# Altium schematic sheet Power.SchDoc
size A4; SheetNumber: 2; SheetTotal: 2
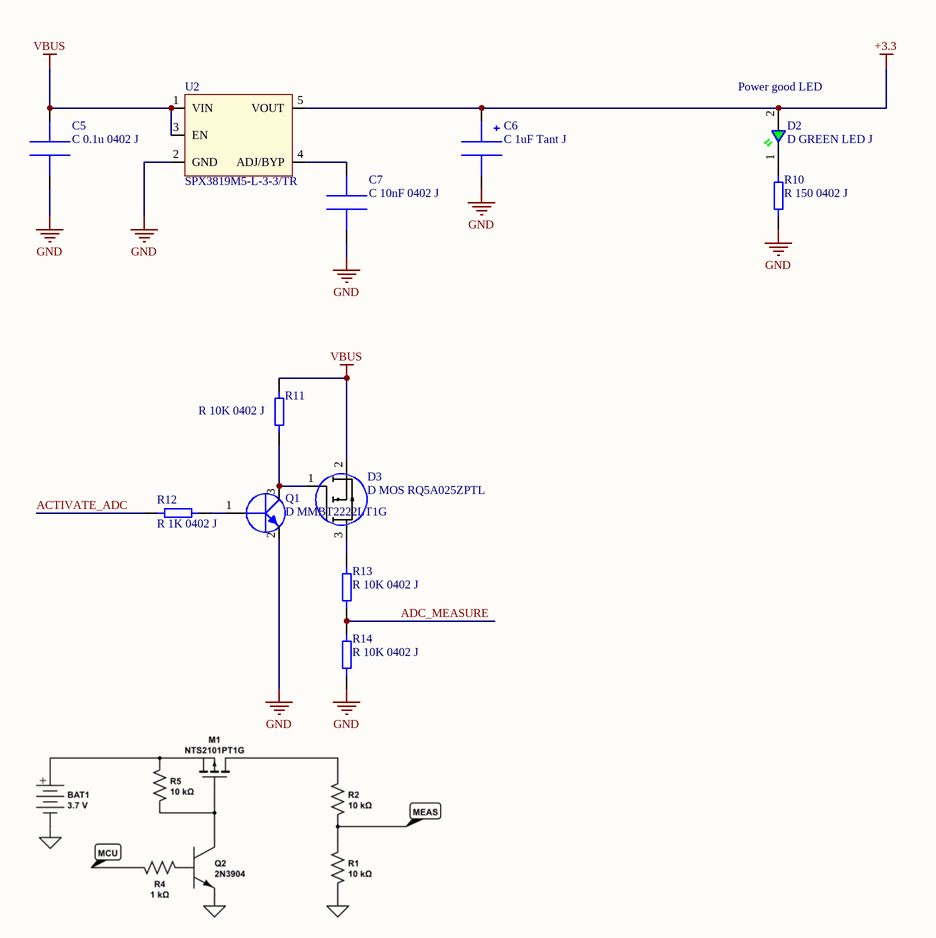
[diagram p0: Power.SchDoc]

## Parts
C5  C 0.1u 0402 J  [C0402]
C6  C 1uF Tant J  [C AVX CAP TANT CASE A]
C7  C 10nF 0402 J  [C0402]
D2  D GREEN LED J  [NCD0402C1]
D3  D MOS RQ5A025ZPTL  [SC96 SOT346T]
Q1  D MMBT2222LT1G  [SOT23]
R10  R 150 0402 J  [R0402]
R11  R 10K 0402 J  [R0402]
R12  R 1K 0402 J  [R0402]
R13  R 10K 0402 J  [R0402]
R14  R 10K 0402 J  [R0402]
U2  SPX3819M5-L-3-3/TR  [SOT23-5]

## Nets
+3.3: C6.A D2.2 U2.5(VOUT)
GND: C5.1 C6.K C7.1 Q1.2 R10.1 R14.1 U2.2(GND)
VBUS: C5.2 D3.2(S) R11.2 U2.1(VIN) U2.3(EN)
ACTIVATE_ADC: R12.1
ADC_MEASURE: R13.1 R14.2
NetC7_2: C7.2 U2.4(ADJ/BYP)
NetD2_1: D2.1 R10.2
NetD3_1: D3.1(G) Q1.3 R11.1
NetD3_3: D3.3(D) R13.2
NetQ1_1: Q1.1 R12.2

## Notes on the sheet
- (near D2) Power good LED

## Library data of the parts
C5 = C 0.1u 0402 J: Cap Ceramic 0.1uF 50V X7R 10% Pad SMD 0402 125C Low ESR Automotive CL05B104KB54PNC; Manufacturer: Samsung; Supplier 1: Digi-Key; Manufacturer Part Number: CL05B104KB54PNC; RoHS: Yes; Category: Ceramic Capacitors; Stock 1: 3863336; Pricing 1: 1=0,10000, 10=0,04600, 50=0,02500, 100=0,02040, 500=0,01460, 1000=0,01147, 2500=0,01043, 5000=0,00959 (USD); RoHS Compliant: Yes; Supplier Part Number 1: 1276-CL05B104KB54PNCCT-ND; JLCPCB: C307331
C6 = C 1uF Tant J: Cap Tant Solid 1uF 16V A CASE 10%( 3.2 X 1.6 X 1.6mm) Inward L SMD 3216-18 11 Ohm 125C T/R TAJA105K016RNJ; Manufacturer: Kyocera AVX; Dielectric Material: Tantalum; Tolerance: 20%; ESR (Equivalent Series Resistance): 11R; Polarity: Polar; Leakage Current: 500nA; Dissipation Factor: 4%; Supplier 1: Digi-Key; Manufacturer Part Number: TAJA105K016RNJ; RoHS: Yes; Category: Tantalum Capacitors; Stock 1: 449202; Pricing 1: 2000=0,09159, 4000=0,08650, 10000=0,08141, 14000=0,07886, 50000=0,07123 (USD); Mount: Surface Mount,PCB; Case/Package: 1206; Number of Pins: 2; Case Code (Metric): 3216; Case Code (Imperial): 1206; Weight: 0.000571oz; Min Operating Temperature: -55°C; Max Operating Temperature: 125°C; Capacitance: 1uF; Voltage Rating (DC): 16V; Packaging: Tape and Reel; Package Quantity: 1; Voltage Rating: 16V; Termination: SMD/SMT; Voltage: 16V; Features: General Purpose; Series: TAJ; Length: 3.2mm; Width: 1.6mm; Height: 1.6mm; Height - Seated (Max): 0.071inch; Depth: 1.6mm; Lead Pitch: 1.1mm; Radiation Hardening: No; REACH SVHC: No SVHC; Lead Free: Lead Free; RoHS Compliant: Yes; ComponentLink1URL: https://datasheet.ciiva.com/18710/taj-eng-18710647.pdf?src-supplier=Distrelec; ComponentLink1Description: https://datasheet.ciiva.com/18710/taj-eng-18710647.pdf?src-supplier=Distrelec; ComponentLink2URL: https://datasheet.ciiva.com/7832/taj-7832811.pdf?src-supplier=Element14; ComponentLink2Description: https://datasheet.ciiva.com/7832/taj-7832811.pdf?src-supplier=Element14; ComponentLink3URL: https://datasheet.ciiva.com/7832/taj-7832810.pdf?src-supplier=Element14; ComponentLink3Description: https://datasheet.ciiva.com/7832/taj-7832810.pdf?src-supplier=Element14; ComponentLink4URL: https://datasheet.ciiva.com/7832/1680476-7832431.pdf?src-supplier=Element14; ComponentLink4Description: https://datasheet.ciiva.com/7832/1680476-7832431.pdf?src-supplier=Element14; ComponentLink5URL: https://datasheet.ciiva.com/263/taj-263410.pdf?src-supplier=Digi-Key; ComponentLink5Description: https://datasheet.ciiva.com/263/taj-263410.pdf?src-supplier=Digi-Key; ComponentLink6URL: https://datasheet.ciiva.com/263/taj-263409.pdf?src-supplier=Digi-Key; ComponentLink6Description: https://datasheet.ciiva.com/263/taj-263409.pdf?src-supplier=Digi-Key; ComponentLink7URL: https://datasheet.ciiva.com/263/taj-263411.pdf?src-supplier=Digi-Key; ComponentLink7Description: https://datasheet.ciiva.com/263/taj-263411.pdf?src-supplier=Digi-Key; ComponentLink8URL: https://datasheet.ciiva.com/7832/1703059-7832429.pdf?src-supplier=Element14; ComponentLink8Description: https://datasheet.ciiva.com/7832/1703059-7832429.pdf?src-supplier=Element14; ComponentLink9URL: https://datasheet.ciiva.com/7832/1703059-7832430.pdf?src-supplier=Element14; ComponentLink9Description: https://datasheet.ciiva.com/7832/1703059-7832430.pdf?src-supplier=Element14; Supplier 2: RSComponents; Stock 2: 1; Pricing 2: 20=0,28300, 100=0,27000, 200=0,25900, 500=0,23500, 1000=0,20900 (USD); JLCPCB: C7174; Supplier Part Number 1: 478-1649-2-ND; Supplier Part Number 2: 1360127
C7 = C 10nF 0402 J: Ceramic capacitor SMD-0402 10nF /50V X7R# K +-10%, Samsung, RoHS CL05B103KB5NNNC; Tolerance: 10%; Voltage Rating: 50V; Dielectric: X7R; Supplier 1: Arrow Electronics; Manufacturer: Samsung; Manufacturer Part Number: CL05B103KB5NNNC; RoHS: Yes; Category: Ceramic Capacitors; Stock 1: 6530000; Pricing 1: 10000=0,00290, 20000=0,00230, 50000=0,00210, 100000=0,00190 (USD); Mount: Surface Mount; Case/Package: 0402; Case Code (Metric): 1005; Case Code (Imperial): 0402; Material: Ceramic; Contact Plating: Tin; Min Operating Temperature: -55°C; Max Operating Temperature: 125°C; Packaging: Tape and Reel; Capacitance: 10nF; Package Quantity: 1; Voltage: 50V; Voltage Rating (DC): 50V; Series: CL; Construction: Flat; Length: 1mm; Width: 0.02inch; Height: 0.5mm; Thickness: 0.022inch; Depth: 0.5mm; Radiation Hardening: No; Lead Free: Lead Free; RoHS Compliant: Yes; ComponentLink1URL: https://datasheet.ciiva.com/15195/getdatasheetpartid-359682-15195636.pdf?src-supplier=Verical; ComponentLink1Description: https://datasheet.ciiva.com/15195/getdatasheetpartid-359682-15195636.pdf?src-supplier=Verical; ComponentLink2URL: https://datasheet.ciiva.com/29198/458761-da-01-en-vs-kondensator-0402-29198432.pdf?src-supplier=Conrad; ComponentLink2Description: https://datasheet.ciiva.com/29198/458761-da-01-en-vs-kondensator-0402-29198432.pdf?src-supplier=Conrad; ComponentLink3URL: https://datasheet.ciiva.com/26309/mlcc-catalogdownload2013-eng-26309005.pdf?src-supplier=Distrelec; ComponentLink3Description: https://datasheet.ciiva.com/26309/mlcc-catalogdownload2013-eng-26309005.pdf?src-supplier=Distrelec; Supplier 2: Digi-Key; Stock 2: 14692768; Pricing 2: 1=0,10000, 10=0,01500, 50=0,00820, 100=0,00670, 500=0,00478, 1000=0,00375, 2500=0,00341, 5000=0,00314 (USD); Supplier 3: Mouser; Stock 3: 2909879; Pricing 3: 1=0,10000, 10=0,00900, 50=0,00900, 100=0,00700, 500=0,00600, 1000=0,00500, 2500=0,00400, 10000=0,00300, 20000=0,00200 (USD); Supplier Part Number 1: CL05B103KB5NNNC; Supplier Part Number 2: 1276-1028-1-ND; Supplier Part Number 3: 187-CL05B103KB5NNNC; JLCPCB: C15195
D2 = D GREEN LED J: Green/Yellow-Green 0402 Light Emitting Diodes (LED) ROHS NCD0402C1; Manufacturer: Foshan NationStar Optoelectronics; Manufacturer Part Number: NCD0402C1; JLCPCB: C130722; ComponentLink1Description: Datasheet; ComponentLink1URL: https://datasheet.lcsc.com/lcsc/2008201033_Foshan-NationStar-Optoelectronics-NCD0402C1_C130722.pdf
D3 = D MOS RQ5A025ZPTL: Transistor Mosfet P-ch 12V 2.5A 3-PIN Tsmt T/r; Manufacturer: Rohm; Supplier 1: Mouser; Manufacturer Part Number: RQ5A025ZPTL; RoHS: Yes; Category: MOSFETs; Stock 1: 4907; Pricing 1: 1=0,58000, 10=0,49900, 50=0,49900, 100=0,37300, 1000=0,24300, 10000=0,20200 (USD); Supplier Part Number 1: 755-RQ5A025ZPTL
Q1 = D MMBT2222LT1G: Trans GP BJT NPN 30V 0.6A 3-Pin SOT-23 T/R; Manufacturer: ON Semiconductor; hFE Min: 100; Frequency: 250MHz; Max Power Dissipation: 225mW; Number of Elements: 1; Max Collector Current: 600mA; Collector Base Voltage (VCBO): 60V; Emitter Base Voltage (VEBO): 5V; Collector Emitter Saturation Voltage: 1.6V; Power Dissipation: 300mW; Element Configuration: Single; Supplier 1: RSComponents; Manufacturer Part Number: MMBT2222LT1G; RoHS: Yes; Category: BJTs; Stock 1: 1600; Pricing 1: 200=0,04200 (USD); Case/Package: SOT-23-3; Number of Pins: 3; Weight: 0.01lb; Contact Plating: Tin,Matte; Min Operating Temperature: -55°C; Max Operating Temperature: 150°C; Collector Emitter Voltage (VCEO): 30V; Package Quantity: 1; Packaging: Tape and Reel; Transition Frequency: 250MHz; Collector Emitter Breakdown Voltage: 30V; Max Breakdown Voltage: 30V; Polarity: NPN; Max Frequency: 250MHz; Termination: SMD/SMT; Gain Bandwidth Product: 250MHz; Voltage Rating (DC): 30V; Current Rating: 600mA; Length: 3.04mm; Width: 2.64mm; Height: 1.11mm; Radiation Hardening: No; REACH SVHC: No SVHC; Lead Free: Lead Free; RoHS Compliant: Yes; ComponentLink1URL: https://datasheet.ciiva.com/976/mmbt2222lt1-d-976368.pdf?src-supplier=Digi-Key; ComponentLink1Description: https://datasheet.ciiva.com/976/mmbt2222lt1-d-976368.pdf?src-supplier=Digi-Key; ComponentLink2URL: https://datasheet.ciiva.com/976/mmbt2222lt1-d-976369.pdf?src-supplier=Digi-Key; ComponentLink2Description: https://datasheet.ciiva.com/976/mmbt2222lt1-d-976369.pdf?src-supplier=Digi-Key; ComponentLink3URL: https://datasheet.ciiva.com/976/mmbt2222lt1-d-976370.pdf?src-supplier=Digi-Key; ComponentLink3Description: https://datasheet.ciiva.com/976/mmbt2222lt1-d-976370.pdf?src-supplier=Digi-Key; ComponentLink4URL: https://datasheet.ciiva.com/7972/mmbt2222lt1-d-7972376.pdf?src-supplier=Element14; ComponentLink4Description: https://datasheet.ciiva.com/7972/mmbt2222lt1-d-7972376.pdf?src-supplier=Element14; ComponentLink5URL: https://datasheet.ciiva.com/22664/1644026-22664155.pdf?src-supplier=Element14; ComponentLink5Description: https://datasheet.ciiva.com/22664/1644026-22664155.pdf?src-supplier=Element14; ComponentLink6URL: https://datasheet.ciiva.com/4721/mmbt2222lt1-d-80103-4721468.pdf?src-supplier=Mouser; ComponentLink6Description: https://datasheet.ciiva.com/4721/mmbt2222lt1-d-80103-4721468.pdf?src-supplier=Mouser; ComponentLink7URL: https://datasheet.ciiva.com/11198/mmbt2222lt1-d-11198974.pdf?src-supplier=Avnet; ComponentLink7Description: https://datasheet.ciiva.com/11198/mmbt2222lt1-d-11198974.pdf?src-supplier=Avnet; ComponentLink8URL: https://datasheet.ciiva.com/11201/mmbt2222lt1-d-11201758.pdf?src-supplier=Avnet; ComponentLink8Description: https://datasheet.ciiva.com/11201/mmbt2222lt1-d-11201758.pdf?src-supplier=Avnet; ComponentLink9URL: https://datasheet.ciiva.com/15224/getdatasheetpartid-91924-15224358.pdf?src-supplier=Verical; ComponentLink9Description: https://datasheet.ciiva.com/15224/getdatasheetpartid-91924-15224358.pdf?src-supplier=Verical; ComponentLink10URL: https://datasheet.ciiva.com/26115/mmbt2222lt1-d-26115112.pdf?src-supplier=Avnet+Europe; ComponentLink10Description: https://datasheet.ciiva.com/26115/mmbt2222lt1-d-26115112.pdf?src-supplier=Avnet+Europe; Supplier Part Number 1: 7814222; JLCPCB: C43496
R10 = R 150 0402 J: Res General Purpose Thick Film 0402 150 Ohm 1% 1/16W ±100ppm/°C Molded SMD Paper T/R RC0402FR-07150RL; Manufacturer: Yageo; Resistance: 150R; Power Rating: 62.5mW; Voltage Rating: 50V; Max Power Dissipation: 63mW; Supplier 1: Arrow Electronics; Manufacturer Part Number: RC0402FR-07150RL; RoHS: Yes; Category: Chip SMD Resistors; Stock 1: 70000; Pricing 1: 10000=0,00140 (USD); Case/Package: 0402; Case Code (Metric): 1005; Case Code (Imperial): 0402; Min Operating Temperature: -55°C; Max Operating Temperature: 155°C; Tolerance: 1%; Packaging: Tape and Reel; Package Quantity: 1; Resistor Type: Thick Film; Number of Terminations: 2; Termination: SMD/SMT; Temperature Coefficient: 100ppm/°C; Working Voltage: 50V; Features: Moisture Resistant; Series: RC; Resistance Tolerance: 1%; Construction: Rectangular; Technology: THICK FILM; Length: 1mm; Width: 0.02inch; Height: 0.016inch; Depth: 0.5mm; REACH SVHC: No SVHC; Military Standard: Not; Lead Free: Lead Free; RoHS Compliant: Yes; ComponentLink1URL: https://datasheet.ciiva.com/11808/0900766b80c66297-11808422.pdf?src-supplier=RSComponents; ComponentLink1Description: https://datasheet.ciiva.com/11808/0900766b80c66297-11808422.pdf?src-supplier=RSComponents; ComponentLink2URL: https://datasheet.ciiva.com/7983/1018594-7983495.pdf?src-supplier=Element14; ComponentLink2Description: https://datasheet.ciiva.com/7983/1018594-7983495.pdf?src-supplier=Element14; ComponentLink3URL: https://datasheet.ciiva.com/2453/pyu-r-int-thick-7-2453374.pdf?src-supplier=Digi-Key; ComponentLink3Description: https://datasheet.ciiva.com/2453/pyu-r-int-thick-7-2453374.pdf?src-supplier=Digi-Key; ComponentLink4URL: https://datasheet.ciiva.com/2453/pyu-r-int-thick-7-2453375.pdf?src-supplier=Digi-Key; ComponentLink4Description: https://datasheet.ciiva.com/2453/pyu-r-int-thick-7-2453375.pdf?src-supplier=Digi-Key; ComponentLink5URL: https://datasheet.ciiva.com/2453/pyu-r-int-thick-7-2453373.pdf?src-supplier=Digi-Key; ComponentLink5Description: https://datasheet.ciiva.com/2453/pyu-r-int-thick-7-2453373.pdf?src-supplier=Digi-Key; ComponentLink6URL: https://datasheet.ciiva.com/5558/pyu-rc0402-51-rohs-l-6-r-5558110.pdf?src-supplier=Mouser; ComponentLink6Description: https://datasheet.ciiva.com/5558/pyu-rc0402-51-rohs-l-6-r-5558110.pdf?src-supplier=Mouser; ComponentLink7URL: https://datasheet.ciiva.com/7849/1018594-7849838.pdf?src-supplier=Element14; ComponentLink7Description: https://datasheet.ciiva.com/7849/1018594-7849838.pdf?src-supplier=Element14; ComponentLink8URL: https://datasheet.ciiva.com/7849/1018594-7849839.pdf?src-supplier=Element14; ComponentLink8Description: https://datasheet.ciiva.com/7849/1018594-7849839.pdf?src-supplier=Element14; ComponentLink9URL: https://datasheet.ciiva.com/16740/pyu-rc0402-51-rohs-l-6-r-16740923.pdf?src-supplier=Future+Electronics; ComponentLink9Description: https://datasheet.ciiva.com/16740/pyu-rc0402-51-rohs-l-6-r-16740923.pdf?src-supplier=Future+Electronics; ComponentLink10URL: https://datasheet.ciiva.com/15189/getdatasheetpartid-330680-15189357.pdf?src-supplier=Verical; ComponentLink10Description: https://datasheet.ciiva.com/15189/getdatasheetpartid-330680-15189357.pdf?src-supplier=Verical; Supplier 2: RSComponents; Stock 2: 10800; Pricing 2: 10000=0,00200, 50000=0,00200, 100000=0,00200, 200000=0,00200, 400000=0,00200 (GBP); Supplier 3: Digi-Key; Stock 3: 2629290; Pricing 3: 1=0,10000, 10=0,01500, 100=0,00610, 1000=0,00275, 2500=0,00239, 5000=0,00197 (USD); JLCPCB: C138054; Supplier Part Number 1: RC0402FR-07150RL; Supplier Part Number 2: 1987666; Supplier Part Number 3: 311-150LRCT-ND
R11 R13 R14 = R 10K 0402 J: Res Thick Film 0402 10K Ohm 1% 0.063W(1/16W) ±100ppm/C Pad SMD Automotive T/R AC0402FR-0710KL; Manufacturer: Yageo; Resistance: 10kR; Power Rating: 62.5mW; Voltage Rating: 50V; Temperature Coefficient: 100ppm/°C; Max Power Dissipation: 63mW; Supplier 1: Arrow Electronics; Manufacturer Part Number: AC0402FR-0710KL; RoHS: Yes; Category: Chip SMD Resistors; Stock 1: 46; Pricing 1: 1=0,08140, 10=0,02850, 25=0,02750 (USD); Case/Package: 0402; Case Code (Imperial): 0402; Case Code (Metric): 1005; Size Code: 0402; Min Operating Temperature: -55°C; Max Operating Temperature: 155°C; Tolerance: 1%; Packaging: Tape and Reel; Resistor Type: Thick Film; Termination: SMD/SMT; Number of Terminations: 2; Features: Moisture Resistant,Automotive AEC-Q200; Series: AC; Construction: Rectangular; Length: 0.039inch; Width: 0.02inch; Height: 0.015inch; Depth: 0.5mm; Military Standard: Not; Lead Free: Lead Free; RoHS Compliant: Yes; ComponentLink1URL: https://datasheet.ciiva.com/12656/pyu-ac-51-rohs-l-2-12656634.pdf?src-supplier=Mouser; ComponentLink1Description: https://datasheet.ciiva.com/12656/pyu-ac-51-rohs-l-2-12656634.pdf?src-supplier=Mouser; Supplier 2: RSComponents; Stock 2: 17000; Pricing 2: 10000=0,00200 (GBP); Supplier 3: Digi-Key; Stock 3: 1574588; Pricing 3: 1=0,10000, 10=0,02000, 100=0,00830, 1000=0,00371, 2500=0,00322, 5000=0,00266 (USD); Supplier 4: Mouser; Stock 4: 3990115; Pricing 4: 1=0,10000, 10=0,01500, 50=0,01500, 100=0,00700, 1000=0,00300, 5000=0,00200, 10000=0,00200 (USD); Supplier Part Number 1: AC0402FR-0710KL; Supplier Part Number 2: 1977965; Supplier Part Number 3: YAG3436CT-ND; Supplier Part Number 4: 603-AC0402FR-0710KL; JLCPCB: C144807
R12 = R 1K 0402 J: Res Thick Film 0402 1K Ohm 1% 0.063W(1/16W) ±100ppm/C Pad SMD Automotive T/R; Manufacturer: Yageo; Manufacturer Part Number: AC0402FR-071KL; Resistance: 1kR; Power Rating: 62.5mW; Voltage Rating: 50V; Max Power Dissipation: 63mW; Temperature Coefficient: 100ppm/°C; Supplier 1: Arrow Electronics; RoHS: Yes; Category: Chip SMD Resistors; Stock 1: 269; Pricing 1: 1=0,05050, 10=0,03670, 25=0,01910, 100=0,00800, 250=0,00790 (USD); Case/Package: 0402; Case Code (Metric): 1005; Case Code (Imperial): 0402; Size Code: 0402; Min Operating Temperature: -55°C; Max Operating Temperature: 155°C; Package Quantity: 1; Tolerance: 1%; Packaging: Tape and Reel; Resistor Type: Thick Film; Number of Terminations: 2; Termination: SMD/SMT; Features: Moisture Resistant,Automotive AEC-Q200,Anti-Sulfur; Series: AC; Construction: Rectangular; Length: 0.039inch; Width: 0.02inch; Height: 0.015inch; Depth: 0.5mm; Military Standard: Not; Lead Free: Lead Free; RoHS Compliant: Yes; ComponentLink1URL: http://www.mouser.com/ds/2/447/yageodocoutput-1111992.pdf?src-supplier=Mouser; ComponentLink1Description: http://www.mouser.com/ds/2/447/yageodocoutput-1111992.pdf?src-supplier=Mouser; ComponentLink2URL: http://www.yageo.com/NewPortal/yageodocoutput?fileName=/pdf/R-Chip/PYu-AC_51_RoHS_L_6.pdf&src-supplier=Digi-Key; ComponentLink2Description: http://www.yageo.com/NewPortal/yageodocoutput?fileName=/pdf/R-Chip/PYu-AC_51_RoHS_L_6.pdf&src-supplier=Digi-Key; ComponentLink3URL: http://www.yageo.com/documents/recent/PYu-AC_51_RoHS_L_2_revised.pdf?src-supplier=Future+Electronics; ComponentLink3Description: http://www.yageo.com/documents/recent/PYu-AC_51_RoHS_L_2_revised.pdf?src-supplier=Future+Electronics; Supplier 2: RSComponents; Stock 2: 109000; Pricing 2: 5000=0,00300 (GBP); Supplier 3: Digi-Key; Stock 3: 1440182; Pricing 3: 1=0,10000, 10=0,02000, 100=0,00830, 1000=0,00371, 2500=0,00322, 5000=0,00266 (USD); Supplier 4: Mouser; Stock 4: 1563596; Pricing 4: 1=0,10000, 10=0,01500, 50=0,01500, 100=0,00700, 1000=0,00300, 10000=0,00200 (USD); Supplier Part Number 1: AC0402FR-071KL; Supplier Part Number 2: 1977971P; Supplier Part Number 3: 311-1KLBCT-ND; Supplier Part Number 4: 603-AC0402FR-071KL; JLCPCB: C144789
U2 = U SPX3819M5 3.3V: SPX3819 Series 3.3 V 500 mA Fixed Output SMT LDO Regulator - SOT-23-5; Manufacturer: MaxLinear; Supplier 1: Mouser; Manufacturer Part Number: SPX3819M5-L-3-3/TR; RoHS: Yes; Category: Voltage Regulators - Linear; Stock 1: 726; Pricing 1: 1=0,56000, 10=0,45600, 50=0,45600, 100=0,32800, 1000=0,21500, 10000=0,19500 (USD); RoHS Compliant: Yes; Supplier 2: RSComponents; Stock 2: 290; Pricing 2: 10=0,59100, 50=0,46800, 100=0,45400, 250=0,39800, 500=0,33700, 10=0,42700, 50=0,33800, 100=0,32800, 250=0,28700, 500=0,24300 (USD); Supplier Part Number 2: 8472888; Supplier Part Number 1: 701-SPX3819M5-L-33TR; JLCPCB: C9055